# EAGLE schematic auto (EAGLE 6.1)
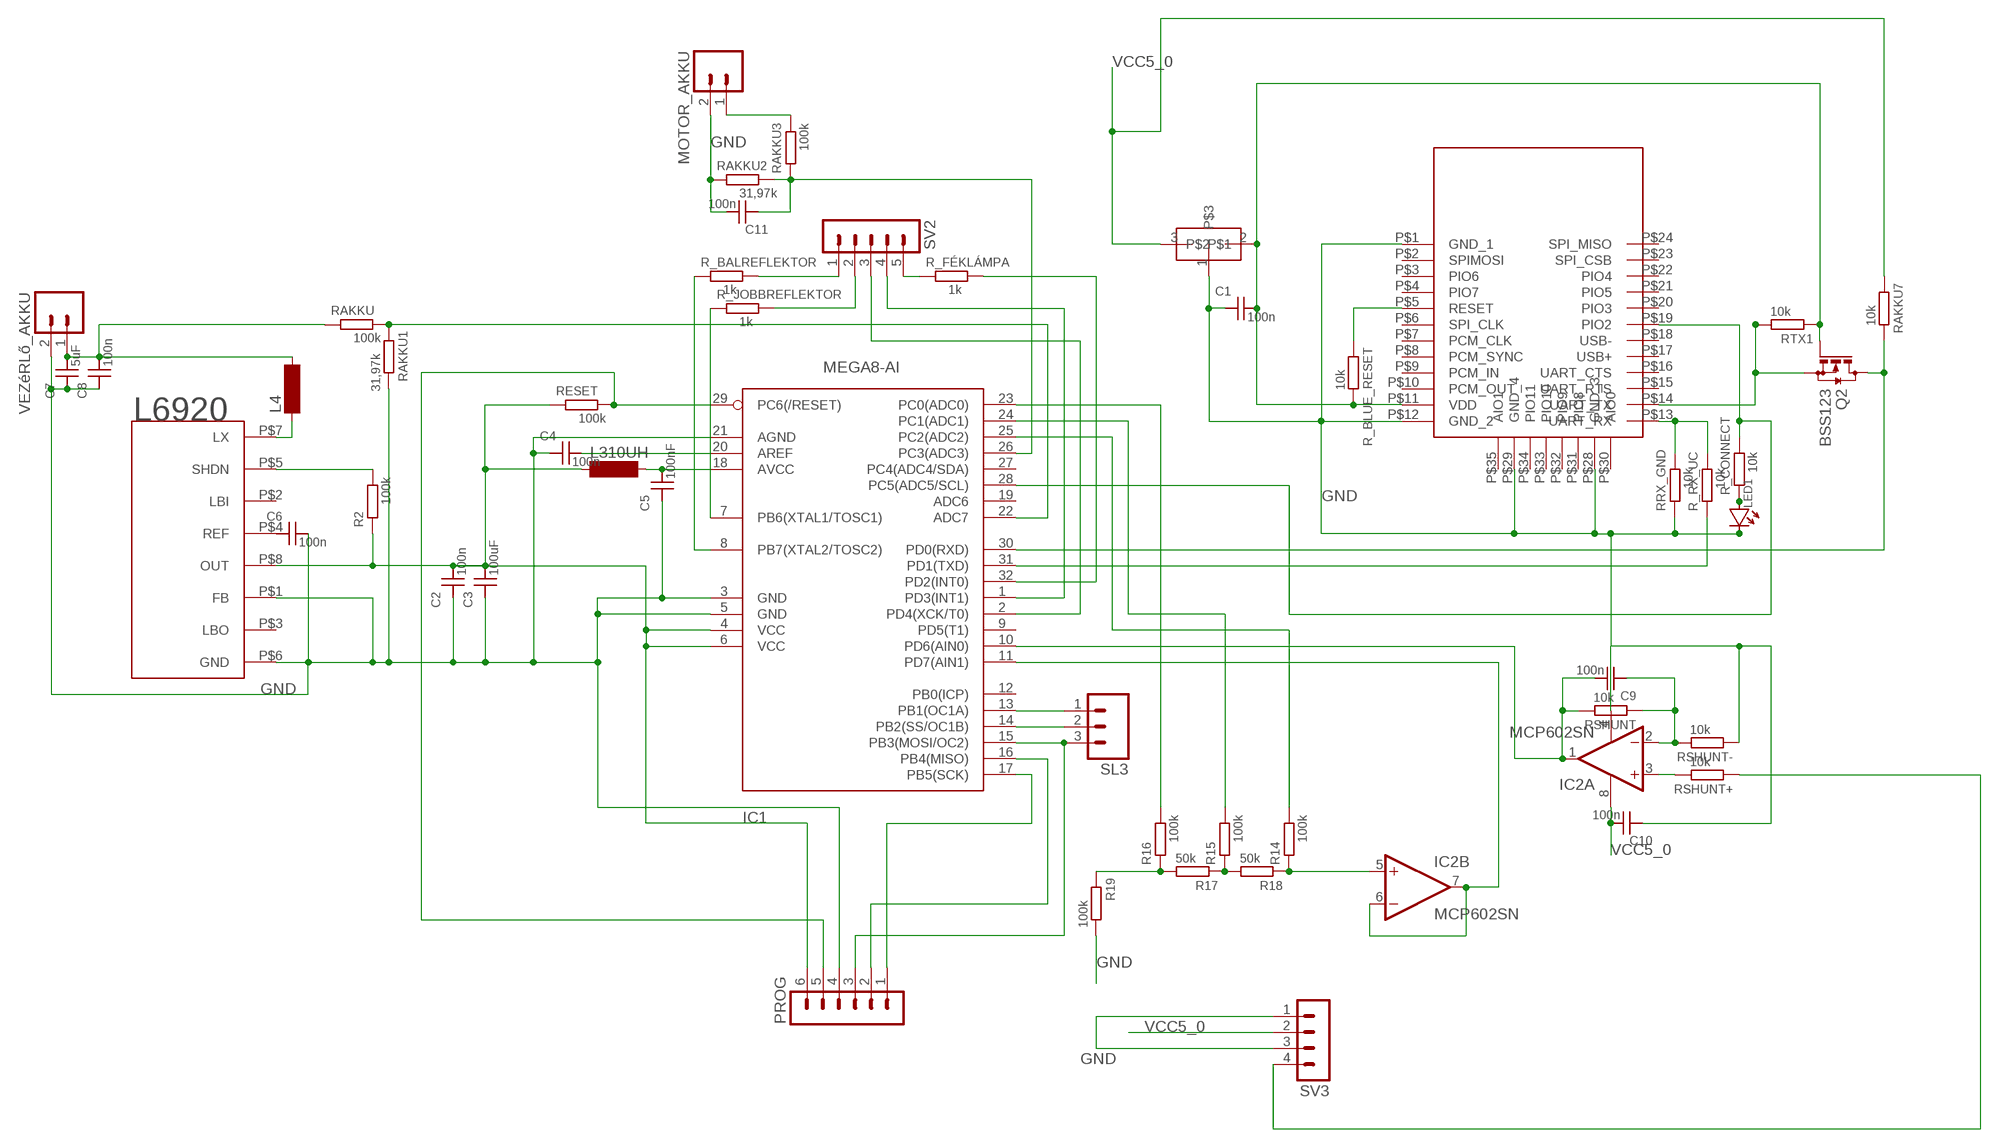
[diagram p0: schematic, sheet 1]

## Parts
C1  100n  C  [1206]
C2  100n  C  [1206]
C3  100uF  C  [1206]
C4  100n  C  [1206]
C5  100nF  C  [1206]
C6  100n  C  [1206]
C7  5uF  C  [1206]
C8  100n  C  [1206]
C9  100n  C  [1206]
C10  100n  C  [1206]
C11  100n  C  [1206]
IC1  MEGA8-AI  [TQFP32-08]
IC2  MCP602SN  [SO08]
L4  SM-NE29  [SM-NE29]
L310UH  SM-NE29  [SM-NE29]
LED1  LED  [1206]
MCP1700-3302  MCP1700-1802  [SOT23]
MOTOR_AKKU  M02  [02P]
PROG  MA06-1  [MA06-1]
Q2  BSS123  [SOT23]
R2  100k  R  [1206]
R14  100k  R  [1206]
R15  100k  R  [1206]
R16  100k  R  [1206]
R17  50k  R  [1206]
R18  50k  R  [1206]
R19  100k  R  [1206]
R_BALREFLEKTOR  1k  R  [1206]
R_BLUE_RESET  10k  R  [1206]
R_CONNECT  10k  R  [1206]
R_FÉKLÁMPA  1k  R  [1206]
R_JOBBREFLEKTOR  1k  R  [1206]
R_RX_UC  10k  R  [1206]
RAKKU  100k  R  [1206]
RAKKU1  31,97k  R  [1206]
RAKKU2  31,97k  R  [1206]
RAKKU3  100k  R  [1206]
RAKKU7  10k  R  [1206]
RESET  100k  R  [1206]
RRX_GND  10k  R  [1206]
RSHUNT  10k  R  [1206]
RSHUNT+  10k  R  [1206]
RSHUNT-  10k  R  [1206]
RTX1  10k  R  [1206]
SL3  MA03  [03P]
SV2  MA05-1  [MA05-1]
SV3  MA04-1  [MA04-1]
U$1  L6920  [L6920]
U$7  RN41  [RN41]
VEZéRLő_AKKU  M02  [02P]

## Nets
AKKU_1: C7.PIN+ C8.PIN+ L4.2 RAKKU.PIN VEZéRLő_AKKU.1
GND: C1.PIN C2.PIN C3.PIN C4.PIN C5.PIN C6.PIN+ C7.PIN C8.PIN C10.PIN C11.PIN+ IC1.3(GND) IC1.5(GND) IC1.21(AGND) IC2.4(P:V-) LED1.PIN+(L-) MCP1700-3302.1 MOTOR_AKKU.1 MOTOR_AKKU.2 PROG.4 R19.PIN+ RAKKU1.PIN+ RAKKU2.PIN RAKKU3.PIN+ RRX_GND.PIN RSHUNT-.PIN SV3.1 SV3.3 U$1.P$1(FB) U$1.P$6(GND) U$7.P$1(GND_1) U$7.P$12(GND_2) U$7.P$28(GND_3) U$7.P$29(GND_4) VEZéRLő_AKKU.2
MISO: IC1.16(PB4(MISO)) PROG.2
N$1: LED1.PIN(L+) R_CONNECT.PIN
N$2: L4.1 U$1.P$7(LX)
N$3: C5.PIN+ IC1.18(AVCC) L310UH.2
N$4: C4.PIN+ IC1.20(AREF)
N$5: R2.PIN+ U$1.P$5(SHDN)
N$6: C6.PIN U$1.P$4(REF)
N$7: IC1.14(PB2(SS/OC1B)) SL3.2
N$8: IC1.30(PD0(RXD)) Q2.3(D) RAKKU7.PIN+
N$9: IC1.31(PD1(TXD)) R_RX_UC.PIN
N$10: IC1.13(PB1(OC1A)) SL3.1
N$11: R_FÉKLÁMPA.PIN SV2.5
N$12: IC1.1(PD3(INT1)) SV2.4
N$13: Q2.2(S) RTX1.PIN+ U$7.P$14(UART_TX)
N$14: C11.PIN IC1.26(PC3(ADC3)) RAKKU2.PIN+ RAKKU3.PIN
N$15: IC1.8(PB7(XTAL2/TOSC2)) R_BALREFLEKTOR.PIN
N$16: R_RX_UC.PIN+ RRX_GND.PIN+ U$7.P$13(UART_RX)
N$17: IC1.28(PC5(ADC5/SCL)) R_CONNECT.PIN+ U$7.P$19(PIO2)
N$18: C9.PIN IC2.2(A:-IN) RSHUNT-.PIN+ RSHUNT.PIN
N$19: IC1.29(PC6(/RESET)) PROG.5 RESET.PIN+
N$20: C9.PIN+ IC1.10(PD6(AIN0)) IC2.1(A:OUT) RSHUNT.PIN+
N$21: R_JOBBREFLEKTOR.PIN+ SV2.2
N$22: R_BLUE_RESET.PIN U$7.P$5(RESET)
N$23: IC2.3(A:+IN) RSHUNT+.PIN+
N$24: IC1.11(PD7(AIN1)) IC2.6(B:-IN) IC2.7(B:OUT)
N$25: IC1.2(PD4(XCK/T0)) SV2.3
N$26: R15.PIN R17.PIN R18.PIN+
N$27: IC1.17(PB5(SCK)) PROG.1
N$28: IC1.32(PD2(INT0)) R_FÉKLÁMPA.PIN+
N$29: IC2.5(B:+IN) R14.PIN R18.PIN
N$30: IC1.23(PC0(ADC0)) R16.PIN+
N$31: IC1.24(PC1(ADC1)) R15.PIN+
N$32: IC1.25(PC2(ADC2)) R14.PIN+
N$33: R16.PIN R17.PIN+ R19.PIN
N$36: IC1.15(PB3(MOSI/OC2)) PROG.3 SL3.3
N$39: IC1.22(ADC7) RAKKU1.PIN RAKKU.PIN+
N$40: R_BALREFLEKTOR.PIN+ SV2.1
N$42: IC1.7(PB6(XTAL1/TOSC1)) R_JOBBREFLEKTOR.PIN
SHUNT: RSHUNT+.PIN SV3.4
VCC3_3: C1.PIN+ MCP1700-3302.2 Q2.1(G) R_BLUE_RESET.PIN+ RTX1.PIN U$7.P$11(VDD)
VCC5_0: C2.PIN+ C3.PIN+ C10.PIN+ IC1.4(VCC) IC1.6(VCC) IC2.8(P:V+) L310UH.1 MCP1700-3302.3 PROG.6 R2.PIN RAKKU7.PIN RESET.PIN SV3.2 U$1.P$8(OUT)
Unconnected: IC1.9(PD5(T1)) IC1.12(PB0(ICP)) IC1.19(ADC6) IC1.27(PC4(ADC4/SDA)) U$1.P$2(LBI) U$1.P$3(LBO) U$7.P$2(SPIMOSI) U$7.P$3(PIO6) U$7.P$4(PIO7) U$7.P$6(SPI_CLK) U$7.P$7(PCM_CLK) U$7.P$8(PCM_SYNC) U$7.P$9(PCM_IN) U$7.P$10(PCM_OUT) U$7.P$15(UART_RTS) U$7.P$16(UART_CTS) U$7.P$17(USB+) U$7.P$18(USB-) U$7.P$20(PIO3) U$7.P$21(PIO5) U$7.P$22(PIO4) U$7.P$23(SPI_CSB) U$7.P$24(SPI_MISO) U$7.P$30(AIO0) U$7.P$31(PIO8) U$7.P$32(PIO9) U$7.P$33(PIO10) U$7.P$34(PIO11) U$7.P$35(AIO1)

## Library data of the parts
C1-C11 = USBEXPLORER:C
IC1 = avr-1:MEGA8: MICROCONTROLLER 8 Kbytes FLASH 1 kbytes SRAM 512 bytes EEPROM USART 6-channel 10 bit ADC 2-channel 8 bit ADC
IC2 = linear:MCP602: Single Op Amp 2.7V to 6.0V Single Supply CMOS Source: http://ww1.microchip.com/downloads/en/DeviceDoc/21314g.pdf
L4 L310UH = inductor-neosid:SM-NE29: INDUCTOR SMD chip inductor; OC_FARNELL: unknown; OC_NEWARK: unknown
LED1 = USBEXPLORER:LED
MCP1700-3302 = MCP1700:MCP1700-1802
MOTOR_AKKU VEZéRLő_AKKU = con-amp-quick:M02: AMP QUICK CONNECTOR; OC_FARNELL: unknown; OC_NEWARK: unknown
PROG = con-lstb:MA06-1: PIN HEADER; OC_FARNELL: unknown; OC_NEWARK: unknown
Q2 = transistor-small-signal:BSS123: N-CHANNEL MOS FET
R2 R14-R19 R_BALREFLEKTOR R_BLUE_RESET R_CONNECT R_FÉKLÁMPA R_JOBBREFLEKTOR R_RX_UC RAKKU RAKKU1-RAKKU3 RAKKU7 RESET RRX_GND RSHUNT RSHUNT+ RSHUNT- RTX1 = USBEXPLORER:R
SL3 = con-amp-quick:MA03: AMP QUICK CONNECTOR; OC_FARNELL: unknown; OC_NEWARK: unknown
SV2 = con-lstb:MA05-1: PIN HEADER; OC_FARNELL: unknown; OC_NEWARK: unknown
SV3 = con-lstb:MA04-1: PIN HEADER; OC_FARNELL: unknown; OC_NEWARK: unknown
U$1 = l6920:L6920
U$7 = rn41:RN41